# EAGLE board main_board (EAGLE 5.01), part 1 of 2
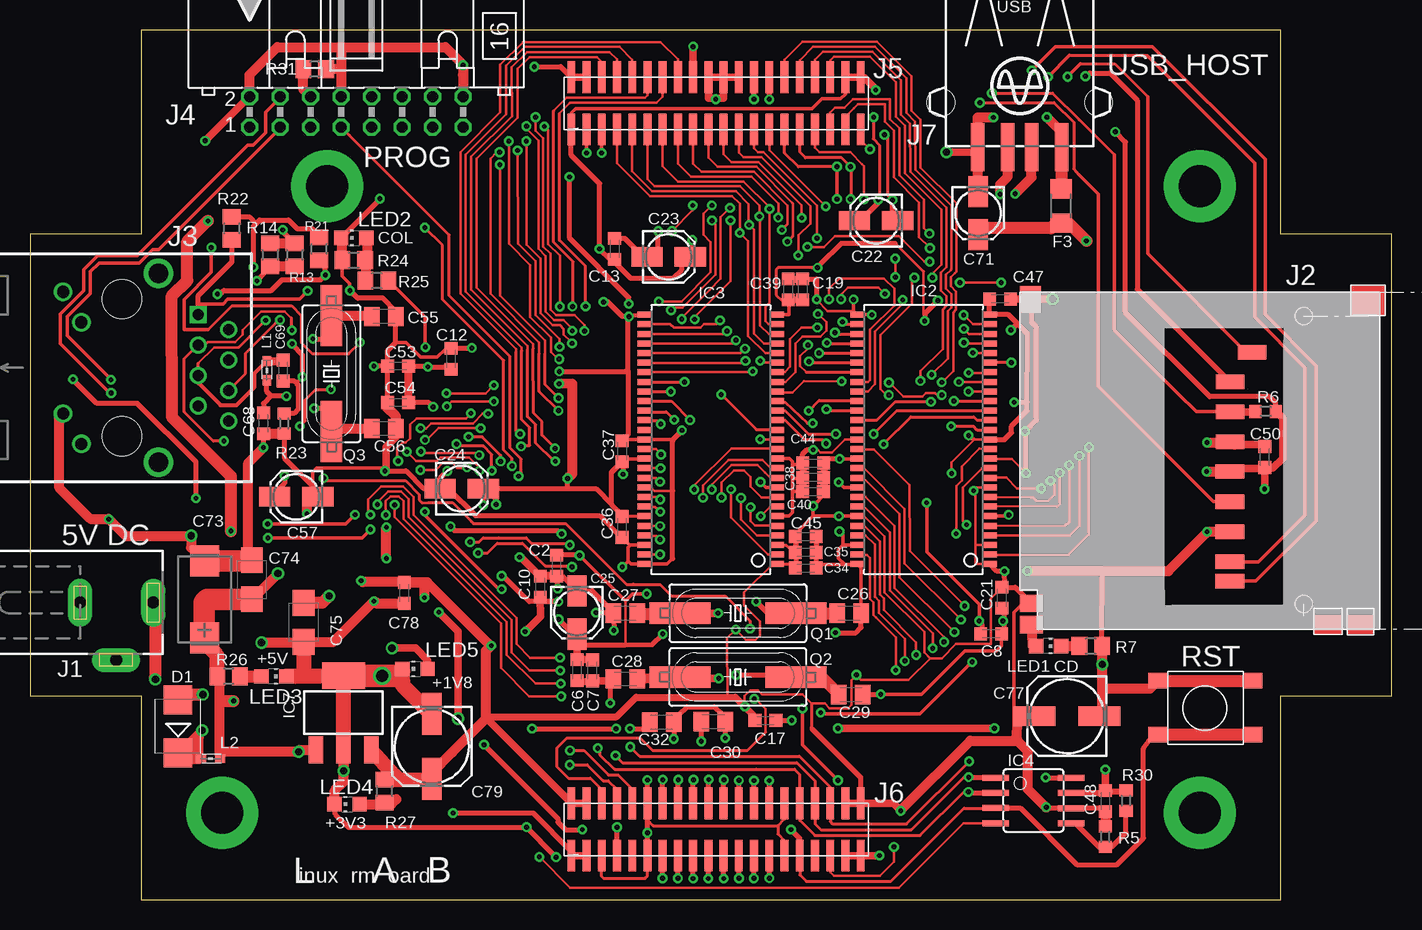
[diagram p2: board, top side]
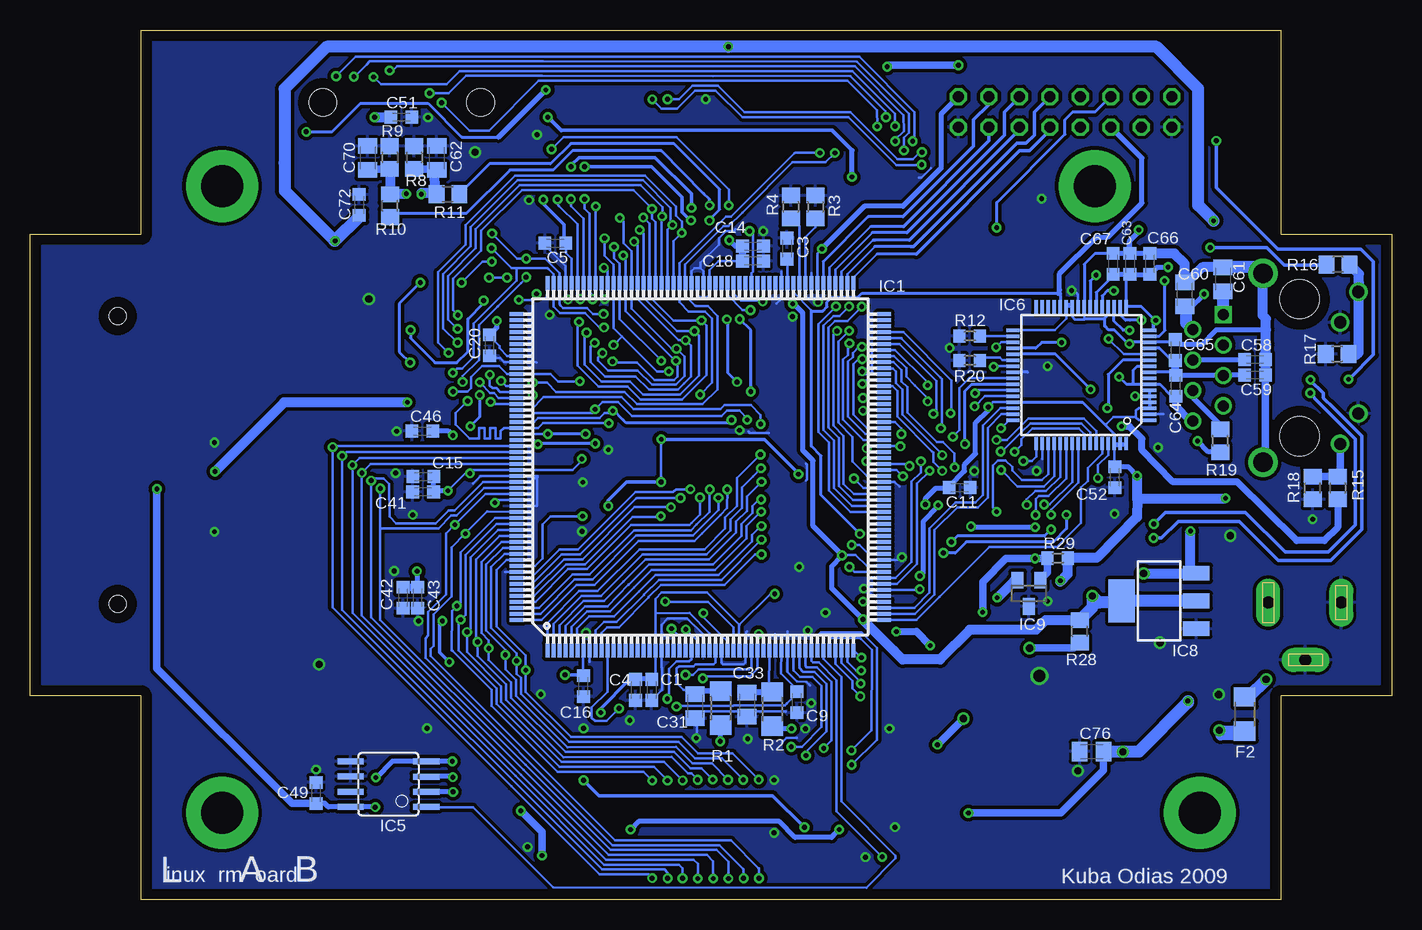
[diagram p3: board, bottom side, seen from below]

Size 113.5 x 72.5 mm. Coordinates in mm from the lower left corner, seen from the top.
Outline: 9.25,0 104.25,0 104.25,17 113.5,17 113.5,55.5 104.25,55.5 104.25,72.5 9.25,72.5 9.25,55.5 0,55.5 0,17 9.25,17 9.25,0
Copper layers (1*16): Top 0.035mm / dielectric 1.5mm / Bottom 0.035mm
Design rules "default *": minimum track width 0.2mm, minimum drill 0.4mm, track to track 0.2mm, track to pad 0.2mm, pad to pad 0.18mm, via to via 0.2mm, smd to smd 0.1mm, copper to edge 35mil, drill to drill 8mil, minimum pad ring 10mil, minimum via ring 8mil, stop-mask expansion 4mil, vias tented up to drill 0mil, thermal gap 10mil

## Footprints (pad centres in the part's own frame; a part is rotated, then mirrored left to right if it is on the bottom)
C0603K = smd 1.05 x 1.08: 1 -0.875,0; 2 0.875,0
153CLV-0405 = smd 2.6 x 1.6: + 1.8,0; - -1.8,0
C0805K = smd 1.3 x 1.6: 1 -1,0; 2 1,0
CT7343 = smd 2.6 x 2.4: + -3.2,0; - 3.2,0
B/3528-21W = smd 2.15 x 1.8: + 1.625,0; - -1.625,0
153CLV-0605 = smd 3.5 x 1.6: + 2.7,0; - -2.7,0
SMB = smd 2.4 x 2.4: A 2.2,0; C -2.2,0
R1206 = smd 1.6 x 1.803: 1 1.118,1.27; 2 3.962,1.27
PQFP208 = smd 1.2 x 0.32: 1 -3.87,24.18; 2 -3.87,23.68; 3 -3.87,23.18; 4 -3.87,22.68; 5 -3.87,22.18; 6 -3.87,21.68; 7 -3.87,21.18; 8 -3.87,20.68; 9 -3.87,20.18; 10 -3.87,19.68; 11 -3.87,19.18; 12 -3.87,18.68; 13 -3.87,18.18; 14 -3.87,17.68; 15 -3.87,17.18; 16 -3.87,16.68; 17 -3.87,16.18; 18 -3.87,15.68; 19 -3.87,15.18; 20 -3.87,14.68; 21 -3.87,14.18; 22 -3.87,13.68; 23 -3.87,13.18; 24 -3.87,12.68; 25 -3.87,12.18; 26 -3.87,11.68; 27 -3.87,11.18; 28 -3.87,10.68; 29 -3.87,10.18; 30 -3.87,9.68; 31 -3.87,9.18; 32 -3.87,8.68; 33 -3.87,8.18; 34 -3.87,7.68; 35 -3.87,7.18; 36 -3.87,6.68; 37 -3.87,6.18; 38 -3.87,5.68; 39 -3.87,5.18; 40 -3.87,4.68; 41 -3.87,4.18; 42 -3.87,3.68; 43 -3.87,3.18; 44 -3.87,2.68; 45 -3.87,2.18; 46 -3.87,1.68; 47 -3.87,1.18; 48 -3.87,0.68; 49 -3.87,0.18; 50 -3.87,-0.32; 51 -3.87,-0.82; 52 -3.87,-1.32; 105 26.73,-1.32; 106 26.73,-0.82; 107 26.73,-0.32; 108 26.73,0.18; 109 26.73,0.68; 110 26.73,1.18; 111 26.73,1.68; 112 26.73,2.18; 113 26.73,2.68; 114 26.73,3.18; 115 26.73,3.68; 116 26.73,4.18; 117 26.73,4.68; 118 26.73,5.18; 119 26.73,5.68; 120 26.73,6.18; 121 26.73,6.68; 122 26.73,7.18; 123 26.73,7.68; 124 26.73,8.18; 125 26.73,8.68; 126 26.73,9.18; 127 26.73,9.68; 128 26.73,10.18; 129 26.73,10.68; 130 26.73,11.18; 131 26.73,11.68; 132 26.73,12.18; 133 26.73,12.68; 134 26.73,13.18; 135 26.73,13.68; 136 26.73,14.18; 137 26.73,14.68; 138 26.73,15.18; 139 26.73,15.68; 140 26.73,16.18; 141 26.73,16.68; 142 26.73,17.18; 143 26.73,17.68; 144 26.73,18.18; 145 26.73,18.68; 146 26.73,19.18; 147 26.73,19.68; 148 26.73,20.18; 149 26.73,20.68; 150 26.73,21.18; 151 26.73,21.68; 152 26.73,22.18; 153 26.73,22.68; 154 26.73,23.18; 155 26.73,23.68; 156 26.73,24.18 | smd 0.32 x 1.2: 53 -1.32,-3.87; 54 -0.82,-3.87; 55 -0.32,-3.87; 56 0.18,-3.87; 57 0.68,-3.87; 58 1.18,-3.87; 59 1.68,-3.87; 60 2.18,-3.87; 61 2.68,-3.87; 62 3.18,-3.87; 63 3.68,-3.87; 64 4.18,-3.87; 65 4.68,-3.87; 66 5.18,-3.87; 67 5.68,-3.87; 68 6.18,-3.87; 69 6.68,-3.87; 70 7.18,-3.87; 71 7.68,-3.87; 72 8.18,-3.87; 73 8.68,-3.87; 74 9.18,-3.87; 75 9.68,-3.87; 76 10.18,-3.87; 77 10.68,-3.87; 78 11.18,-3.87; 79 11.68,-3.87; 80 12.18,-3.87; 81 12.68,-3.87; 82 13.18,-3.87; 83 13.68,-3.87; 84 14.18,-3.87; 85 14.68,-3.87; 86 15.18,-3.87; 87 15.68,-3.87; 88 16.18,-3.87; 89 16.68,-3.87; 90 17.18,-3.87; 91 17.68,-3.87; 92 18.18,-3.87; 93 18.68,-3.87; 94 19.18,-3.87; 95 19.68,-3.87; 96 20.18,-3.87; 97 20.68,-3.87; 98 21.18,-3.87; 99 21.68,-3.87; 100 22.18,-3.87; 101 22.68,-3.87; 102 23.18,-3.87; 103 23.68,-3.87; 104 24.18,-3.87; 157 24.18,26.73; 158 23.68,26.73; 159 23.18,26.73; 160 22.68,26.73; 161 22.18,26.73; 162 21.68,26.73; 163 21.18,26.73; 164 20.68,26.73; 165 20.18,26.73; 166 19.68,26.73; 167 19.18,26.73; 168 18.68,26.73; 169 18.18,26.73; 170 17.68,26.73; 171 17.18,26.73; 172 16.68,26.73; 173 16.18,26.73; 174 15.68,26.73; 175 15.18,26.73; 176 14.68,26.73; 177 14.18,26.73; 178 13.68,26.73; 179 13.18,26.73; 180 12.68,26.73; 181 12.18,26.73; 182 11.68,26.73; 183 11.18,26.73; 184 10.68,26.73; 185 10.18,26.73; 186 9.68,26.73; 187 9.18,26.73; 188 8.68,26.73; 189 8.18,26.73; 190 7.68,26.73; 191 7.18,26.73; 192 6.68,26.73; 193 6.18,26.73; 194 5.68,26.73; 195 5.18,26.73; 196 4.68,26.73; 197 4.18,26.73; 198 3.68,26.73; 199 3.18,26.73; 200 2.68,26.73; 201 2.18,26.73; 202 1.68,26.73; 203 1.18,26.73; 204 0.68,26.73; 205 0.18,26.73; 206 -0.32,26.73; 207 -0.82,26.73; 208 -1.32,26.73
TSOP54 = smd 0.5 x 1.2: 1 1.03,-0.422; 2 1.83,-0.422; 3 2.63,-0.422; 4 3.43,-0.422; 5 4.23,-0.422; 6 5.03,-0.422; 7 5.83,-0.422; 8 6.63,-0.422; 9 7.43,-0.422; 10 8.23,-0.422; 11 9.03,-0.422; 12 9.83,-0.422; 13 10.63,-0.422; 14 11.43,-0.422; 15 12.23,-0.422; 16 13.03,-0.422; 17 13.83,-0.422; 18 14.63,-0.422; 19 15.43,-0.422; 20 16.23,-0.422; 21 17.03,-0.422; 22 17.83,-0.422; 23 18.63,-0.422; 24 19.43,-0.422; 25 20.23,-0.422; 26 21.03,-0.422; 27 21.83,-0.422; 28 21.83,10.582; 29 21.03,10.582; 30 20.23,10.582; 31 19.43,10.582; 32 18.63,10.582; 33 17.83,10.582; 34 17.03,10.582; 35 16.23,10.582; 36 15.43,10.582; 37 14.63,10.582; 38 13.83,10.582; 39 13.03,10.582; 40 12.23,10.582; 41 11.43,10.582; 42 10.63,10.582; 43 9.83,10.582; 44 9.03,10.582; 45 8.23,10.582; 46 7.43,10.582; 47 6.63,10.582; 48 5.83,10.582; 49 5.03,10.582; 50 4.23,10.582; 51 3.43,10.582; 52 2.63,10.582; 53 1.83,10.582; 54 1.03,10.582
SOIC8 = smd 0.5 x 2.2: 1 0.635,-0.614; 2 1.895,-0.614; 3 3.165,-0.614; 4 4.435,-0.614; 5 4.445,5.694; 6 3.175,5.694; 7 1.905,5.694; 8 0.635,5.694
LQFP64 = smd 1.1 x 0.285: 1 -5.7,3.75; 2 -5.7,3.25; 3 -5.7,2.75; 4 -5.7,2.25; 5 -5.7,1.75; 6 -5.7,1.25; 7 -5.7,0.75; 8 -5.7,0.25; 9 -5.7,-0.25; 10 -5.7,-0.75; 11 -5.7,-1.25; 12 -5.7,-1.75; 13 -5.7,-2.25; 14 -5.7,-2.75; 15 -5.7,-3.25; 16 -5.7,-3.75; 33 5.7,-3.75; 34 5.7,-3.25; 35 5.7,-2.75; 36 5.7,-2.25; 37 5.7,-1.75; 38 5.7,-1.25; 39 5.7,-0.75; 40 5.7,-0.25; 41 5.7,0.25; 42 5.7,0.75; 43 5.7,1.25; 44 5.7,1.75; 45 5.7,2.25; 46 5.7,2.75; 47 5.7,3.25; 48 5.7,3.75 | smd 0.285 x 1.1: 17 -3.75,-5.7; 18 -3.25,-5.7; 19 -2.75,-5.7; 20 -2.25,-5.7; 21 -1.75,-5.7; 22 -1.25,-5.7; 23 -0.75,-5.7; 24 -0.25,-5.7; 25 0.25,-5.7; 26 0.75,-5.7; 27 1.25,-5.7; 28 1.75,-5.7; 29 2.25,-5.7; 30 2.75,-5.7; 31 3.25,-5.7; 32 3.75,-5.7; 49 3.75,5.7; 50 3.25,5.7; 51 2.75,5.7; 52 2.25,5.7; 53 1.75,5.7; 54 1.25,5.7; 55 0.75,5.7; 56 0.25,5.7; 57 -0.25,5.7; 58 -0.75,5.7; 59 -1.25,5.7; 60 -1.75,5.7; 61 -2.25,5.7; 62 -2.75,5.7; 63 -3.25,5.7; 64 -3.75,5.7
SOT223 = smd 1.219 x 2.235: 1 1.499,0.711; 2 3.81,0.711; 3 6.121,0.711 | smd 3.6 x 2.2: 4 3.81,6.909
SOT23 = smd 1 x 1.4: 1 0.32,1.44; 2 2.22,1.44; 3 1.27,3.64
DCJ0303 = drill 1 pad 2 long: 1 0,3.1; 2 4.8,0; 3 0,-3
SDCARD = smd 2.4 x 1.2: 1 17.53,-5.46; 2 17.53,-7.96; 3 17.53,-10.47; 4 17.525,-12.955; 5 17.525,-15.46; 6 17.525,-17.965; 7 17.52,-20.47; 8 17.525,-22.085; 9 19.37,-3 | smd 1.95 x 1.4: CD 0.975,-23.95 | smd 1.95 x 1.45: COMM 0.975,-25.735 | smd 1.75 x 2.2: S3 0.88,1.405 | hole 1.4: 23.68,0; 23.675,-24
PJ-J0 = drill 0.914 square: 1 -5.715,5.08 | drill 0.914 round: 2 -6.985,2.54; 3 -8.255,5.08; 4 -9.525,2.54; 5 -10.795,5.08; 6 -12.065,2.54; 7 -13.335,5.08; 8 -14.605,2.54 | drill 1.016 round: 9 -3.835,16.332; 10 -6.375,14.808; 11 -13.97,16.332; 12 -16.51,14.808 | drill 1.626 round: S1 -18.034,8.382; S2 -2.286,8.382 | hole 3.251: -15.875,11.43; -4.445,11.43
ML16L = drill 0.914 octagon: 1 -8.89,-1.27; 2 -8.89,1.27; 3 -6.35,-1.27; 4 -6.35,1.27; 5 -3.81,-1.27; 6 -3.81,1.27; 7 -1.27,-1.27; 8 -1.27,1.27; 9 1.27,-1.27; 10 1.27,1.27; 11 3.81,-1.27; 12 3.81,1.27; 13 6.35,-1.27; 14 6.35,1.27; 15 8.89,-1.27; 16 8.89,1.27
PLHTD40S-GC = smd 2.65 x 0.65: 1 0,24.13; 2 0,22.86; 3 0,21.59; 4 0,20.32; 5 0,19.05; 6 0,17.78; 7 0,16.51; 8 0,15.24; 9 0,13.97; 10 0,12.7; 11 0,11.43; 12 0,10.16; 13 0,8.89; 14 0,7.62; 15 0,6.35; 16 0,5.08; 17 0,3.81; 18 0,2.54; 19 0,1.27; 20 0,0; 21 4.35,0; 22 4.35,1.27; 23 4.35,2.54; 24 4.35,3.81; 25 4.35,5.08; 26 4.35,6.35; 27 4.35,7.62; 28 4.35,8.89; 29 4.35,10.16; 30 4.35,11.43; 31 4.35,12.7; 32 4.35,13.97; 33 4.35,15.24; 34 4.35,16.51; 35 4.35,17.78; 36 4.35,19.05; 37 4.35,20.32; 38 4.35,21.59; 39 4.35,22.86; 40 4.35,24.13
USB-A003 = smd 1.12 x 4: 1 -3.5,14; 2 -1,14; 3 1,14; 4 3.5,14 | hole 2.3: -6.57,10.28; 6.57,10.28
0603 = smd 0.85 x 0.7: 1 -0.9,0; 2 0.7,0
CHIP-LED0805 = smd 1.2 x 1.2: A 0,-1.05; C 0,1.05
SM49 = smd 5.08 x 1.778: 1 -4.826,0; 2 4.826,0
R1206' = smd 1.6 x 1.803: 1 -1.422,0; 2 1.422,0
R0805 = smd 1.3 x 1.5: 1 -0.95,0; 2 0.95,0
R0603 = smd 1 x 1.1: 1 -0.85,0; 2 0.85,0
DTSM-62N = smd 1.3 x 1.55: P$1 0,0; P$2 0,7.95; P$3 4.5,0; P$4 4.5,7.95

## Placement (x,y rotation side)
C1  100n  [C0603K]  61.67,17.48 270 bottom
C2  100n  [C0603K]  43.9,27.84 270 top
C3  100n  [C0603K]  50.38,54.27 90 bottom
C4  100n  [C0603K]  63.01,17.48 270 bottom
C5  100n  [C0603K]  69.7,54.71 180 bottom
C6  100n  [C0603K]  45.6,19.12 270 top
C7  100n  [C0603K]  46.88,19.11 270 top
C8  100n  [C0603K]  80.12,22.16 0 top
C9  100n  [C0603K]  49.57,16.44 270 bottom
C10  100n  [C0603K]  42.54,26.09 90 top
C11  100n  [C0603K]  35.99,34.34 0 bottom
C12  100n  [C0603K]  35.1,45.09 90 top
C13  100n  [C0603K]  48.74,54.25 90 top
C14  100n  [C0603K]  53.23,54.47 0 bottom
C15  100n  [C0603K]  80.72,35.25 180 bottom
C16  100n  [C0603K]  67.36,17.8 270 bottom
C17  100n  [C0603K]  61.31,14.92 0 top
C18  100n  [C0603K]  53.23,53.24 0 bottom
C19  100n  [C0603K]  64.4,50.87 90 top
C20  100n  [C0603K]  75.19,46.2 270 bottom
C21  100n  [C0603K]  81,25.16 270 top
C22  10uF/25V  [153CLV-0405]  70.53,56.6 180 top
C23  10uF/25V  [153CLV-0405]  53.24,53.58 0 top
C24  10uF/25V  [153CLV-0405]  35.99,34.26 0 top
C25  10uF/25V  [153CLV-0405]  45.59,23.93 270 top
C26  10p  [C0805K]  68.28,23.88 180 top
C27  10p  [C0805K]  49.61,23.88 0 top
C28  10p  [C0805K]  49.63,18.4 0 top
C29  10p  [C0805K]  68.43,17.09 180 top
C30  5.6n  [C0805K]  56.96,14.83 180 top
C31  680p  [C0805K]  58.05,16.12 90 bottom
C32  4.7n  [C0805K]  52.65,14.79 180 top
C33  470p  [C0805K]  53.73,16.24 90 bottom
C34  100n  [C0603K]  64.68,27.63 0 top
C35  100n  [C0603K]  64.68,28.95 0 top
C36  100n  [C0603K]  49.35,31.06 270 top
C37  100n  [C0603K]  49.36,37.39 90 top
C38  100n  [C0603K]  65.28,35.2 180 top
C39  100n  [C0603K]  63.21,50.87 90 top
C40  100n  [C0603K]  65.27,34.01 180 top
C41  100n  [C0603K]  80.73,33.99 180 bottom
C42  100n  [C0603K]  82.4,25.16 270 bottom
C43  100n  [C0603K]  81.19,25.16 270 bottom
C44  100n  [C0603K]  65.28,36.39 180 top
C45  100n  [C0603K]  64.68,30.26 0 top
C46  100n  [C0603K]  80.79,39.06 180 bottom
C47  100n  [C0603K]  80.87,50.07 0 top
C48  100n  [C0603K]  89.65,8.22 270 top
C49  100n  [C0603K]  89.65,8.89 270 bottom
C50  100n  [C0603K]  102.92,36.89 270 top
C51  100n  [C0603K]  82.55,65.23 0 bottom
C52  100n  [C0603K]  23.07,35.21 270 bottom
C53  100n  [C0603K]  30.69,44.48 180 top
C54  100n  [C0603K]  30.69,41.43 180 top
C55  22p  [C0805K]  29.52,48.61 180 top
C56  22p  [C0805K]  29.52,39.27 180 top
C57  10uF/25V  [153CLV-0405]  22.2,33.58 180 top
C58  100n  [C0603K]  11.39,45.02 0 bottom
C59  100n  [C0603K]  11.39,43.73 0 bottom
C60  10p  [C0805K]  17.24,50.45 270 bottom
C61  10p  [C0805K]  14.05,51.72 270 bottom
C62  47p  [C0805K]  79.59,61.82 90 bottom
C63  100n  [C0603K]  21.8,52.99 90 bottom
C64  100n  [C0603K]  17.99,42.83 270 bottom
C65  100n  [C0603K]  18.02,45.82 90 bottom
C66  100n  [C0603K]  20.15,52.99 90 bottom
C67  100n  [C0603K]  23.21,52.99 90 bottom
C68  100n  [C0603K]  19.46,39.7 270 top
C69  100n  [C0603K]  21.1,44.1 270 top
C70  47p  [C0805K]  85.35,61.83 90 bottom
C71  10uF/10V  [153CLV-0405]  79.04,57.23 270 top
C72  100n  [C0603K]  86.05,57.91 90 bottom
C73  100uF/16V  [CT7343]  14.56,25.02 90 top
C74  10uF/16V  [B/3528-21W]  18.5,26.67 270 top
C75  10uF/16V  [B/3528-21W]  22.82,23.11 90 top
C76  470n  [C0805K]  25,12.34 0 bottom
C77  47uF/16V  [153CLV-0605]  86.44,15.29 180 top
C78  100n  [C0603K]  31.21,25.56 270 top
C79  47uF/16V  [153CLV-0605]  33.5,12.77 270 top
D1  P6SMB6,8A  [SMB]  12.34,14.44 90 top
F2  1A  [R1206]  10.97,12.92 90 bottom
F3  0.25A  [R1206]  84.68,60.37 270 top
IC1  AT91RM9200  [PQFP208]  46.18,24.64 90 bottom
IC2  K4S561632J  [TSOP54]  79.56,26.93 90 top
IC3  K4S561632J  [TSOP54]  61.84,26.93 90 top
IC4  AT45DB021D  [SOIC8]  81.11,10.8 270 top
IC5  AT93C66  [SOIC8]  81.08,7.08 90 bottom
IC6  STE100P-LQFP64  [LQFP64]  25.86,43.72 180 bottom
IC7  LM3940IMP-3.3  [SOT223]  22.33,11.77 0 top
IC8  LM1117MP-1.8  [SOT223]  15.58,21.08 90 bottom
IC9  DS1818  [SOT23]  28.96,28.07 180 bottom
J1  5V DC  [DCJ0303]  7.18,24.77 270 top
J2  X6173-15  [SDCARD]  82.51,48.64 0 top
J3  J0011  [PJ-J0]  19.09,54.5 90 top
J4  PROG  [ML16L]  27.2,65.67 0 top
J5  PLHTD40S-GC  [PLHTD40S-GC]  69.25,64.2 90 top
J6  PLHTD40S-GC  [PLHTD40S-GC]  69.25,3.66 90 top
J7  USB_HOST  [USB-A003]  82.52,76.73 180 top
L1  LCBA-601  [0603]  19.74,44.2 90 top
L2  LCBA-601  [0603]  15.14,11.74 0 top
LED1  YELLOW  [CHIP-LED0805]  84.92,21.14 270 top
LED2  RED  [CHIP-LED0805]  26.99,55.16 90 top
LED3  GREEN  [CHIP-LED0805]  20.34,18.61 270 top
LED4  YELLOW  [CHIP-LED0805]  26.43,7.95 90 top
LED5  RED  [CHIP-LED0805]  32.1,19.23 90 top
Q1  18.432M  [SM49]  59.01,23.88 0 top
Q2  32.768k  [SM49]  59.01,18.54 180 top
Q3  25M  [SM49]  25.13,43.85 90 top
R1  1.27k/1%  [R1206']  55.93,15.96 90 bottom
R2  1.96k/1%  [R1206']  51.62,15.88 90 bottom
R3  1k  [R0805]  48.03,57.75 270 bottom
R4  1k  [R0805]  50.07,57.75 270 bottom
R5  10k  [R0603]  89.64,5.24 90 top
R6  10k  [R0603]  103.01,40.7 0 top
R7  390R  [R0805]  88.43,21.13 180 top
R8  15k  [R0805]  81.47,61.87 270 bottom
R9  15k  [R0805]  83.5,61.87 270 bottom
R10  27R  [R0805]  83.5,57.84 90 bottom
R11  27R  [R0805]  78.66,58.81 0 bottom
R12  10k  [R0603]  35.15,46.99 0 bottom
R13  10k/1%  [R0805]  22.05,53.75 270 top
R14  10k/1%  [R0805]  20.02,53.75 270 top
R15  330R  [R0805]  4.49,34.31 270 bottom
R16  330R  [R0805]  4.45,52.96 180 bottom
R17  1k  [R0805]  4.53,45.5 0 bottom
R18  1k  [R0805]  6.58,34.31 90 bottom
R19  100R  [R0805]  14.27,38.24 90 bottom
R20  10k  [R0603]  35.15,44.94 0 bottom
R21  49.9R/1%  [R0805]  24.1,54.25 90 top
R22  49.9R/1%  [R0805]  16.83,55.95 90 top
R23  0R  [R0603]  21.2,39.69 90 top
R24  1k  [R0805]  26.99,53.31 0 top
R25  330R  [R0805]  28.91,51.59 180 top
R26  560R  [R0805]  16.56,18.61 180 top
R27  220R  [R0805]  29.56,9.04 90 top
R28  0R  [R0805]  25.99,22.35 90 bottom
R29  10k  [R0603]  27.83,28.46 0 bottom
R30  0R  [R0603]  91.37,8.25 270 top
R31  47k  [R0805]  23.74,69.22 180 top
S1  RESET  [DTSM-62N]  101.96,13.74 90 top

## Tracks (layer width: path | path; a pad name or v marks a point on that pad's centre or on a via)
+1V8  (via drill 0.4, 0.6)
  Top 0.2: C25.+ 45.61,22.1 45.4,21.24 | 49.62,21.24 49.63,24.89
  Top 0.254: v70.72,58.35 70.83,58.47 70.83,58.51 70.83,62.9 70.3,63.42 70.31,65.13 v70.33,65.23
  Top 0.305: v51.42,25.48 50.21,25.48 49.63,24.9 49.63,24.89 45.99,28.52 | v74.76,33.08 74.76,28.96 79.13,24.6 v79.13,23.23 | v78.54,19.8 74.2,15.46 66.03,15.47 v65.91,15.59
  Top 0.406: 45.4,21.24 49.62,21.24 51.87,21.26 52.72,22.11 v52.76,22.14 | v79.13,23.23 79.31,22.98 79.33,22.94 79.34,22.4 C8.1 | 69.46,56.86 68.77,56.69 | 69.46,56.86 C22.+ | v70.72,58.35 70.72,58.12 69.46,56.86 | v44.99,60.24 44.99,55.13 49.91,50.2 v49.91,49.67 v49.92,49.66 | C25.+ 45.3,22.12 v44.07,23.35 | C25.+ | C25.+ 45.61,22.12 | C25.+ 45.6,22.19 | C2.1 45.79,28.71 v45.82,28.69
  Top 0.61: 45.61,20.02 C6.1 | 45.61,22.12 45.61,20.02 | 46.9,20 46.9,19.98 | 46.9,20 C7.1 | 45.61,20.02 46.9,20.02 46.9,20
  Top 1.016: C75.+ 24.37,24.74 v24.93,25.3
  Bottom 0.2: IC1.33 54.38,20.79 54.38,22.88 | 54.38,22.88 54.38,22.92 57.06,25.61 60.84,25.61 61.37,25.08 61.37,23.87 | C1.1 61.7,18.35 61.7,18.36 61.37,18.7 IC1.19 61.36,20.67 61.37,20.67 | 61.37,23.87 58.53,23.88 56.86,22.17 56.86,20.92 56.87,20.83 56.86,20.79 IC1.28 | 61.37,23.87 61.37,20.67 | 61.37,20.67 | 54.38,22.88 | 54.38,22.88 54.35,22.91 | IC1.37 52.35,21.72 v52.76,22.14 | 54.38,22.88 54.38,22.9 51.78,25.47 51.63,25.47 v51.42,25.48 | 72.93,33.33 IC1.188 74.52,33.32 v74.76,33.08 | C5.1 68.8,53.91 68.81,53.91 68.36,53.46 IC1.152 | 50.41,53.39 50.42,53.4 | 50.41,53.39 C3.1 | 50.41,53.39 50.36,53.34 IC1.116 50.37,51.36 50.35,50.33 50.35,50.1 v49.92,49.66 | IC1.62 43.74,27.82 44.67,28.75 45.83,28.75 45.84,28.73 | 45.84,28.73 | 45.84,28.73 45.82,28.73
  Bottom 0.305: v79.13,23.23 79.23,23.2 79.34,23.09 79.33,20.6 v78.54,19.8 | v65.91,15.59 65.95,15.9 63.56,18.33 63.04,18.33 63.03,18.32 C4.1 | C5.1 68.98,54.87 68.98,56.26 70.72,58.01 v70.72,58.34 v70.72,58.35
  Bottom 0.35: v70.33,65.23 69.22,64.13 46.62,64.11 44.97,62.46
  Bottom 0.406: C4.1 63.05,18.37 63.05,18.38 61.73,18.38 61.7,18.35 | 45.82,28.73 48.22,31.14 48.22,36.6 49.07,37.46 49.07,48.9 49.82,49.65 49.88,49.62 v49.92,49.66 | 44.97,62.46 44.97,60.33 v44.99,60.24 | v44.07,23.35 46.65,25.93 46.65,27.79 45.84,28.6 45.84,28.69 | 45.84,28.69 45.84,28.73 | 45.84,28.69 v45.82,28.69
  Bottom 0.813: R28.2 26.01,23.29 28.84,23.29 29.63,22.49 35.16,22.49 37.64,20.01 40.76,20.02 41.47,20.74 44.07,23.33 v44.07,23.35
  Bottom 1.016: IC8.2 22.47,24.89 22.48,24.89 IC8.4 22.5,24.76 24.39,24.76 v24.93,25.3 24.95,25.28 24.95,24.34 R28.2
+3V3  (via drill 0.4)
  Top 0.2: 60.46,15.21 C17.1 | 58.13,16.96 58.12,21.8 v58.82,22.5 v58.83,22.51 59.68,21.66 60.48,21.66 60.85,22.04 60.85,23.2 59.54,24.51 59.54,25.62 61.95,27.99 62.17,27.99 | 62.17,27.99 62.21,27.99 | 62.17,27.99 IC3.1 62.23,27.95 | IC3.3 62.24,29.54 62.57,29.54 | C35.1 63.81,29.27 63.74,29.34 | 63.84,27.66 63.65,27.95 | 51.23,31.96 IC3.49 | 51.34,36.74 51.22,36.74 IC3.43 | C37.1 49.7,36.74 | 62.28,38.34 62.32,38.34 | 62.28,38.34 IC3.14 | v60.88,38.37 60.88,38.35 62.28,38.34 | 63.25,49.99 C39.1 | 48.35,53.38 C13.1 | IC2.43 68.98,36.75 68.99,36.74 69.01,36.72 | IC2.9 78.96,34.37 v78.67,34.08 78.81,33.92 78.81,29.58 | IC2.1 78.81,27.96 78.81,29.58 | 78.81,29.58 78.88,29.58 78.88,29.56 IC2.3 | v76.83,35.53 76.82,36.45 78.73,38.36 IC2.14 | 69.12,31.96 69.53,31.96 71.24,30.25 71.24,25.61 74.55,22.3 74.55,20.81 74.55,20.59 75.03,20.11 75.05,20.11 74.55,20.61 | 81.35,26.17 81.19,26.01 81.05,26.01 81.02,26.01 80.12,25.11 80.12,21.3 78.05,21.3 78.1,21.29 77.2,21.29 76.02,20.12 75.04,20.12 73.24,18.32 69.27,18.32 68.92,18.67 68.92,18.71 v68.89,18.73 68.71,18.5 68.46,18.25 68.46,16.22 68.18,15.95 67.2,15.95 66.66,15.95 66.26,16.34 65.16,16.34 64.39,17.12 63.98,17.11 61.02,17.11 60.69,17.44 60.04,17.44 59.57,16.97 59.57,16.12 v59.6,16.09 | C45.1 63.79,30.31 | C45.1 | 63.85,30.16 63.79,30.22 C45.1 | C19.1 64.01,49.99 63.95,49.94 62.68,49.94 | 74.58,48.83 74.49,48.84 74.49,49.77 74.49,52.37 | 31.56,41.51 31.56,41.49 31.59,41.46 33.22,41.46 v33.61,41.06 | v33.61,41.06 33.63,41.04 | v33.61,41.07 v33.61,41.06 | IC2.49 69.12,31.96 | 69.12,31.96 69.15,31.96 69.15,31.94 | 67.44,31.94 67.44,31.93 | 67.44,31.94 v67.44,31.96
  Top 0.2: 69.15,31.94 67.44,31.94 | 69.12,31.96 69.12,31.97 | 69.12,31.96 | 69.15,31.94 69.12,31.94 69.12,31.96 | IC2.27 79.98,48.77 | IC2.27 | IC2.27 | 65.16,14.2 65.16,14.19 65.2,14.22 | 20.1,41.99 20.17,41.99 IC6.5 v21.39,41.97 v21.38,41.97
  Top 0.254: 63.74,29.34 63.26,29.34 63.06,29.54 62.57,29.54 | 63.65,27.95 62.23,27.95 | 78.73,38.36 78.73,38.39 78.24,38.38 v78.24,38.7 | v65.66,52.68 65.39,52.68 65.22,52.68 62.37,52.69 62.2,52.51 62.2,50.42 62.68,49.94 | 74.49,52.37 72.14,54.71 | 86.8,7.64 IC4.6 | v84.72,7.7 84.77,7.64 | 65.16,16.34 65.16,14.37 | 35.14,44.25 35.11,44.22 C12.1
  Top 0.3: 65.27,31.97 63.81,30.49 | 65.28,32.83 65.97,33.51 66.3,33.85 v65.3,32.82
  Top 0.305: 60.46,15.23 60.46,15.27 | 49.47,31.97 51.23,31.96 | 49.7,36.74 51.22,36.74 | IC3.9 61.35,34.37 v60.89,34.8 | IC3.27 63.25,48.76 63.25,49.99 | C13.1 48.68,53.19 | v67.44,31.96 67.47,31.96 | v67.49,36.74 68.99,36.74 | 63.81,30.49 63.81,29.27 | 44.58,34.27 44.58,34.26 44.82,34.25 | J2.CD 82.76,24.69 82.03,23.95 82.02,13.35 | IC2.49 65.27,31.96 65.27,31.97 65.27,31.96 65.28,31.96 65.28,32.83 | J5.21 J5.22 67.98,67.17 67.58,66.77 66.02,66.77 65.2,65.95 45.49,65.95 45.13,65.6 45.13,64.24 45.15,64.23 45.15,64.31 45.12,64.34 | 65.16,14.37 65.16,14.2
  Top 0.31: 84.73,7.69 84.74,7.69 | 84.73,7.69 v84.72,7.7 | 84.71,7.69 84.73,7.69 | 81.05,26.01 81.17,26.01 C43.1 | 82.23,25.94 | 82.23,25.94 82.23,25.95 | 82.14,26.03 82.23,25.94 | 72.2,7.66 72.2,7.7 | 69.12,31.96 69.13,31.95
  Top 0.406: IC4.6 | C48.2 89.36,7.64 86.78,7.64 | 60.46,15.21 60.46,15.23 v59.6,16.09 | C35.1 63.85,30.16 63.84,27.66 C34.1 | C36.1 49.42,32.26 49.47,31.97 48.49,32.95 | 49.49,36.46 C37.1 49.36,36.54 | 48.49,32.95 48.49,35.6 | IC2.27 79.97,48.77 79.97,50.36 | 55.21,53.42 v55.21,54.98 | 48.68,53.19 50.07,51.8 53.59,51.79 54.34,52.54 54.34,52.55 54.34,52.56 54.34,52.57 54.34,53.17 54.6,53.42 55.21,53.42 | 48.35,53.38 v47.48,54.25 v47.48,54.26 47.48,59.7 45.12,62.06 J5.1 | 49.36,36.54 49.38,36.55 | 48.49,35.6 48.49,35.67 49.36,36.54 | 48.49,35.6 49.39,36.51 49.42,36.51 49.44,36.49 v49.44,35.45 | 48.49,32.95 47.18,34.27 44.58,34.27 38.77,34.27 38.79,34.25 v38.85,32.93 38.85,34.23 37.81,34.24 C24.+ | IC2.1 80.02,27.96 80.61,27.37 v81.24,27.37 81.27,27.37 81.28,27.36 81.25,27.28 81.26,26.26 81.19,26.19 C21.1 C43.1 82.14,26.03 | v67.49,36.74 v67.49,36.73 66.61,36.73 66.21,36.33 | C47.1 IC2.27 81.58,48.76 82.28,48.05 82.32,48.02 | 82.32,48.02 83.13,47.21 83.11,40.75 | 83.11,40.75 81.82,39.46 81.82,38.92 81.23,38.34 80.01,38.34 IC2.14 | v74.58,48.24 74.58,48.83 v75.69,49.93 | 82.32,48.02 82.28,47.98 82.28,47.92 82.22,47.92 v81.78,47.48 | v65.66,52.68 65.85,52.93 67.63,54.71 72.14,54.71 | C57.+ 20.45,33.94 21.21,34.71 v21.21,35.33 | C53.1 33.05,44.48 v33.17,44.41 33.36,44.41 34.54,44.41 35.17,44.41 35.1,44.29 C12.1 35.08,44.5 | C54.1 33.25,41.43 v33.61,41.07 | C68.1 19.46,41.37 20.07,41.98 v21.37,41.98 v21.38,41.97 | L1.1 19.74,42.36 20.1,41.99 | 37.79,34.23 37.83,34.19 | C24.+ 37.79,34.23 | 37.79,34.23 37.64,34.38 | 37.79,34.21 | 37.79,34.21 C24.+ | v37.79,32.88 37.79,34.21 | 42.54,25.13 C10.1 42.91,24.84 v44.05,24.84 41.61,24.84 41.04,25.4 39.45,26.98 v39.32,26.98
  Top 0.406: C24.+ 37.68,34.37 | v44.82,35.1 44.81,35.1 44.81,34.26 44.58,34.26 | v13.83,33.46 13.83,36.48 8.94,41.37 5.58,41.37 v3.58,43.37 | 18.31,66.99 J4.2 | v14.6,63.26 14.6,63.28 | 83.11,40.75 83.11,41.45 v82.05,41.45 | 82.76,24.69 82.78,25.4 82.23,25.95 82.2,25.98 | 84.77,7.64 86.8,7.64 | 72.57,7.43 72.58,7.41 v72.58,7.39 | 72.2,7.66 | 71.97,8.01 71.97,7.9 72.2,7.66 | R6.2 103.86,40.76 103.89,40.79 103.84,40.84 103.84,41.4 103.31,41.93 98.34,41.93 91.32,48.95 91.32,63.16 v90.47,64.01 | J5.40 44.23,69.44 v42.04,69.44 | 55.03,53.58 55.02,53.59 | 55.03,53.58 C23.+ | 55.21,53.42 55.19,53.42 55.03,53.58 | J6.21 69.23,8.03 69.23,10.19 65.2,14.22
  Top 0.508: 86.78,7.64 IC4.6
  Top 0.6: C44.1 66.21,36.33 66.21,35.17 66.18,35.17 C38.1 66.17,35.18 66.17,34.03 C40.1 | 64.44,49.99 C19.1 | 64.44,49.99 63.25,49.99 | 64.44,49.99 64.44,49.98 | 60.46,15.21 58.81,16.86 50.53,16.86 48.91,15.23 38,15.23
  Top 0.61: C50.2 102.93,35.93 100.27,35.93 J2.4 | R6.2 104.42,40.13 104.42,36.78 103.61,35.97 102.97,35.97 C50.2 | v41.28,22.33 42.56,23.6 42.54,25.13 | 14.6,63.28 18.31,66.99 | J6.40 45.19,8.01 45.2,8.03 45.22,8.01 J6.39 45.14,8.01 38.06,15.09 38,15.09 | 69.22,8.03 69.23,8.01 J6.21 71.97,8.01 v72.58,7.39 | 69.22,8.03 69.34,8.02 | v70.81,3.66 69.31,3.66 69.27,3.62 69.25,3.64 J6.20 68.17,3.66 68.15,3.64 68.13,3.66 J6.19 | J5.39 | J5.40 J5.39 | J5.39 | 68.03,68.55 J5.22 | 68.03,68.55 J5.21 69.28,68.52 69.56,68.53 70.48,67.61 70.6,67.5 v70.49,67.5 | 68.03,68.55 68.03,68.54 | 36.09,68.74 36.09,68.73 36.13,69.57 v36.1,69.56 | C50.2 v102.92,34.22 | J6.22 68,8.03 69.22,8.03
  Top 0.65: C53.1 IC6.39 31.56,41.51
  Top 0.813: C78.1 33.12,26.45 38.41,21.16 v38.45,21.16 38,20.74 38,15.23 38,15.09 35.2,12.26 33.55,10.6 33.5,10.53 C79.+ 33.5,10.43 | C78.1 31.21,26.46 31.43,26.46 31.46,26.44 32.87,26.43 v32.87,25.16 | C78.1 31.18,26.46 27.73,26.46 v27.61,26.59 | v44.1,43 45.23,43.01 45.22,36.05 45.22,35.5 v44.82,35.1 | 25.95,71.06 20.61,71.06 18.29,68.75 18.29,67.03 18.31,67.03 | 25.95,71.06 34.63,71.07 36.09,69.6 36.09,68.74 36.09,67.21 36.06,67.18 36.09,67.14 J4.16 | 18.31,67.03 18.33,67.03 | J4.2 18.31,67.03 | J4.8 25.94,66.96 25.95,69.29 | 25.95,71.06 25.95,69.29 | 100.03,35.67 100.04,35.66 | 100.03,35.67 J2.4 | v98.08,35.69 100.01,35.69 100.03,35.67 | C48.2 89.65,7.29 89.63,7.26 89.64,7.25 R5.2 | 84.71,7.69 83.16,9.22 83.16,12.21 83.18,12.36 | 83.18,12.36 82.3,13.23 78.39,13.23 72.57,7.43 | 83.18,12.36 82.14,13.4 82.29,13.37 82.31,14.95 | 25.95,69.29 25.86,69.29 25.79,69.22 R31.1 | 82.31,14.95 82.34,14.78 | 82.31,14.95 C77.+ | 33.5,10.43 | 33.48,10 33.48,10.41 33.5,10.43
  Top 1.27: IC7.3 30.41,10.33 30.67,10.04 30.49,10 R27.2 33.48,10 33.48,10.79
  Bottom 0.2: 23.1,36.06 23.1,36.05 | 23.1,36.06 arc90 C52.1 | IC6.62 arc90 23.1,38 | 23.1,38 23.1,36.06 | IC6.63 | IC6.63 arc90 22.8,37.83 23.11,37.83 arc90 22.92,38.01 IC6.64 arc-90 IC6.64 | 23.1,38 arc90 23.09,38.01 IC6.63 | IC6.64 arc90 22.3,37.84 22.89,37.84 | IC1.26 57.86,21.54 v58.83,22.51 | IC1.40 50.88,18.84 49.62,17.57 49.62,17.27 | 49.62,17.27 49.62,17.24 | 49.62,17.27 C9.1 49.57,17.2 50.41,16.36 50.44,16.33 50.56,16.2 54.83,16.2 54.91,16.14 57.13,16.14 59.51,16.14 v59.6,16.09 | IC1.7 67.38,20.75 67.38,18.69 C16.1 | v60.88,38.37 60.89,38.35 v60.89,34.8 60.9,34.8 | 60.9,34.8 60.9,34.78 | IC1.131 57.86,50.43 57.67,50.23 57.05,50.23 56.85,50.43 IC1.129 | IC1.129 56.84,51.38 | IC1.129 56.86,51.39 56.86,52.46 56.08,53.24 C18.1 | IC1.111 47.86,53.86 v47.48,54.25 | IC1.199 73.01,27.82 73.03,27.8 72.98,27.81 71.4,27.81 70.79,28.42 70.79,31.27 70.12,31.94 67.44,31.94 | IC1.183 72.91,35.84 | IC1.183 68.29,35.82 67.45,36.66 | 42.33,34.31 42.35,34.31 | 42.33,34.31 IC1.75 | v78.67,34.08 78.67,34.1 76.95,35.82 76.42,35.82 | 76.42,35.82 IC1.183 | 76.42,35.82 76.44,35.82 76.83,35.82 v76.83,35.53 | 60.91,34.8 60.9,34.8 | IC1.146 65.36,52.68 v65.66,52.68 | IC1.164 73.72,45.32 74.37,45.96 74.37,46.14 75.39,47.16 C20.1 | v33.17,44.41 33.12,44.47 IC6.39 | IC6.45 33.21,41.47 v33.61,41.07 33.61,41.06 | IC1.93 42.34,43.31 | IC1.93 | IC6.4 20.18,41.47 20.16,41.45 IC6.3 21.08,40.97 21.3,40.75 21.3,40.19 21.08,39.97 | IC6.6 20.16,42.48 20.18,42.49 | IC6.1 20.28,39.97 21.08,39.97 | IC6.64 22.1,38.02 | IC1.56 42.3,24.82 | IC1.56 | v44.05,24.84 44.03,24.82 IC1.56 | IC1.93 43.81,43.29 v44.1,43 | 42.33,34.31 44.02,34.31 v44.82,35.1 | 21.08,39.97 21.35,40.23 23.2,40.23 23.79,39.65
  Bottom 0.2: 23.79,39.65 | 23.86,39.57 23.79,39.65 | IC6.45 | IC6.45 31.56,41.44 31.5,41.47 33.2,41.47 33.61,41.06 | IC6.45 | 33.61,41.06 33.63,41.03 | v67.44,31.96 67.44,31.94 | 67.44,31.94 | C18.1 | C18.1 | v21.37,41.97 | v21.37,41.97 v21.38,41.97 | IC6.5 v21.37,41.97
  Bottom 0.254: v75.69,49.93 75.69,49.71 76.99,48.41 76.99,45.7 77.92,44.77 79.73,44.77 81.78,46.81 v81.78,47.48 | IC6.62 23.11,38.82 23.86,39.57 25.75,41.46 IC6.45 | R29.2 26.98,28.48 26.99,28.49 27.01,28.47 27.01,27.12 | v67.49,36.74 67.49,36.66 67.45,36.66 | v84.72,7.7 84.74,7.71 | 74.47,63.58 77.51,63.58 80.33,66.39 85.94,66.39 88.33,64 90.44,64 | 90.44,64 v90.47,64 | IC6.5 | IC6.5 20.16,41.5 20.16,41 IC6.4 | 20.16,42.48 IC6.5 | 90.44,64 90.44,64.01 v90.47,64.01
  Bottom 0.3: 60.91,34.8 63.77,34.8 | 63.77,34.8 63.77,34.79 | 63.77,34.8 65.29,33.28 v65.3,32.82
  Bottom 0.305: C16.1 67.44,18.74 v68.89,18.73 | v49.44,35.45 49.44,35.51 52.29,38.36 60.83,38.36 60.87,38.32 60.88,38.33 v60.88,38.37 | 3.4,43.53 1.5,45.43 1.5,53.17 2.55,54.22 9.46,54.22 14.6,59.35 v14.6,63.26 | 18.33,66.92 18.44,66.92 | J4.2 18.33,66.92 | 18.33,66.92 18.26,66.92
  Bottom 0.31: 21.21,33.55 21.28,33.55 21.2,33.48 21.2,33.39
  Bottom 0.406: v55.21,54.98 54.7,54.48 54.68,54.48 54.67,54.48 C14.1 | v38.85,32.93 38.85,33.45 37.98,34.31 37.13,34.3 36.99,34.22 C11.1 36.87,34.42 36.87,34.43 35.59,35.71 35.59,36.26 34.68,37.18 34.68,39.76 33.61,40.82 v33.61,41.07 | C41.1 79.86,33.96 79.85,33.95 79.73,34.08 v78.67,34.08 79.6,34.08 79.85,34.33 79.85,35.14 79.83,35.16 79.85,35.18 C15.1 | C43.1 81.24,26.27 v81.24,27.37 | C46.1 78.61,39.06 v78.24,38.7 | C20.1 74.58,47.67 v74.58,48.24 | C52.1 21.97,36.09 v21.21,35.33 | v37.79,32.88 37.79,32.75 39.03,31.51 39.03,27.27 v39.31,26.98 v39.32,26.98 | v3.58,43.37 3.42,43.53 3.4,43.53 | J4.16 37.56,65.48 37.56,60.97 40.72,57.81 43.95,57.81 47.48,54.28 | 84.74,7.71 IC5.8 | 86.69,7.72 IC5.8 | v36.1,69.56 v36.11,69.55 | 89.35,7.72 89.35,8.02 88.93,8.02 88.63,7.72 IC5.8 | 70.49,67.47 v70.49,67.5 70.54,67.5 74.46,63.58 74.47,63.58
  Bottom 0.61: C42.1 81.84,26.02 81.84,26.01 81.05,26.01 C43.1 | v38.45,21.16 39.62,22.33 v41.28,22.33 | J4.16 | 47.48,54.28 v47.48,54.25 | v72.58,7.39 72.57,7.39 70.81,5.63 v70.81,3.66 | v70.49,67.5 70.51,67.61 | v36.11,69.55 41.94,69.55 42.01,69.47 v42.04,69.44 | C14.1 54.1,54.48 54.09,54.49 54.09,54.48 C18.1 | v102.92,34.22 102.92,19.28 91.66,8.02 91.65,8.02 91.64,8.01 91.64,8.02 C49.2
  Bottom 0.813: IC9.2 31.45,26.58 v32.87,25.16 | v27.61,26.59 v27.6,26.59 | 27.62,26.5 27.01,27.12 27.01,28.5 24.57,28.5 21.21,31.88 21.2,33.39 21.21,33.39 | v21.21,35.32 v21.21,35.33 21.21,35.19 21.2,35.18 21.21,35.17 21.21,33.55 21.21,33.46 v13.83,33.46 | v82.05,41.45 92.31,41.45 v98.08,35.69
+5V  (via drill 0.4, 0.6)
  Top 0.406: J6.1 45.12,4.04 41.95,7.21 v35.27,7.21
  Top 0.61: J6.1 45.15,3.66 45.16,3.64 45.19,3.66 J6.2 | J5.32 | v55.28,71.12 J5.32
  Top 0.813: IC7.1 22.46,12.48 v22.39,12.31 22.39,12.34 16.87,12.36 15.82,12.36 | 14.78,25.04 18.51,25.04 v20.67,27.2 | R26.2 15.82,18.29 15.82,12.36 | L2.2 15.82,12.36
  Top 1.016: v16.76,30.72 16.76,35.28 11.88,40.17 11.87,40.17 11.87,40.21 11.83,50.34 13.11,51.62 13.11,54.88 v14.83,56.59 | v16.97,16.55 16.95,16.53 16.18,16.53 | C71.+ 79.58,55.98 85.11,55.98 85.58,56.45 85.92,56.45 85.92,56.33 F3.2 86.58,56.42 v88.07,54.92
  Top 1.27: R26.2 15.6,18.62 15.6,20.35 14.49,21.46 14.49,21.83 C73.+
  Top 1.778: C73.+ 14.53,21.86 14.53,24.78 14.78,25.04 C74.+
  Bottom 0.61: 55.3,71.1 55.3,71.09 55.3,71.01 v55.28,71.12 | v35.27,7.21 27.57,7.21 24,10.77 24,12.29 23.97,12.32 23.99,12.34 C76.2
  Bottom 0.813: C76.2 23.95,12.34 23.92,12.31 | 16.24,27.2 16.25,27.2 IC8.3 | 16.24,27.2 v20.67,27.2 16.76,27.2 v16.76,30.72 | 16.24,27.2 16.18,27.13
  Bottom 1.016: v16.97,16.55 16.97,16.42 21.04,12.35 22.39,12.35 v22.39,12.31 22.4,12.29 23.95,12.29 C76.2 | v14.83,56.59 16.12,57.88 16.12,67.62 19.58,71.09 55.3,71.09 88.78,71.09 92.28,67.6 92.27,61.42 92.26,59.09 88.12,54.92 | C72.1 86.05,56.98 86.04,56.97 88.09,54.92 88.12,54.92 | 88.12,54.92 88.12,54.94 88.11,54.92 v88.07,54.92
A0/NBS0  (via drill 0.4)
  Top 0.2: v76.01,42.06 75.64,42.06 75.45,42.25 74.69,42.25 74.39,41.96 72.81,41.96 71.67,43.1 v71.61,43.1 71.6,43.08
  Top 0.254: IC2.15 78.95,39.16 78.65,39.47 v76.79,39.47
  Top 0.305: J5.2 v46.41,62.25
  Bottom 0.2: v71.61,43.1 70.41,43.1 69.63,42.32 63.92,42.32 62.9,41.3 57.42,41.3 56.19,42.54 56.18,48.66 56.99,49.47 57.99,49.47 58.03,49.52 58.07,49.52 58.86,50.31 58.86,51.27 58.87,51.28 58.86,51.29 IC1.133 58.88,51.35 | v46.41,62.25 47.18,61.47 49.65,61.47 49.92,61.47 54.12,57.26 55.25,56.15 55.59,56.14 55.69,56.13 58.88,52.94 58.88,51.35 | 58.88,51.35 58.88,51.19
  Bottom 0.254: v76.79,39.47 76.01,40.24 76.01,41.48 v76.01,42.06
A1/NBS2  (via drill 0.4)
  Top 0.2: IC3.15 62.09,39.16 62.06,39.19 62.02,39.15
  Top 0.254: 62.23,39.19 IC3.15 62.28,39.18 | 62.28,39.18 62.3,39.18 | v57.62,42.1 57.65,42.1 60.55,39.19 60.56,39.18 60.69,39.18 62.28,39.18
  Top 0.305: J5.3 v47.66,62.26
  Bottom 0.2: IC1.134 59.38,51.37 | IC1.134 59.36,51.28 59.35,51.26 59.38,51.24 59.38,49.81 58.59,49.03 57.22,49.03 56.65,48.45 56.65,43.09 57.62,42.12 v57.62,42.1 | v47.66,62.26 49.69,62.26 49.76,62.24 55.05,56.94 55.49,56.94 59.36,53.07 IC1.134
A2  (via drill 0.4)
  Top 0.2: IC3.23 62.11,45.56 62.11,45.55 61.3,45.55 59.86,46.99 59.86,54.89 v59.18,55.58 v59.17,55.58 | IC2.23 78.61,45.56 v78.6,45.58 | 59.17,55.67 59.17,57.91 | 59.17,57.91 | J5.4 48.93,61.4 51.67,58.65 58.53,58.65 59.17,58.01 59.17,57.91
  Top 0.305: 59.07,55.7 59.18,55.6 59.17,55.6 v59.17,55.58 59.17,55.65 59.18,55.66 59.17,55.67
  Bottom 0.2: IC1.135 59.86,54.88 v59.17,55.58 v59.17,55.59 59.14,55.63 59.14,56.53 59.63,57.03 59.63,57.79 62.22,60.37 73.05,60.36 77.18,56.23 77.18,54.62 79.48,52.31 79.46,46.44 v78.6,45.58
A3  (via drill 0.4)
  Top 0.2: v59.95,56.26 60.37,55.84 60.36,47.2 61.19,46.37 IC3.24 | IC2.24 77.94,46.36 v77.86,46.44 | 59.89,56.3 59.89,57.8 | 59.89,57.8 | J5.5 50.2,60.73 51.87,59.05 58.84,59.05 59.89,58 59.89,57.8
  Top 0.305: 59.84,56.4 59.98,56.26 v59.95,56.26 59.93,56.26 59.89,56.3
  Bottom 0.2: IC1.136 60.36,55.83 v59.95,56.26 59.95,56.32 59.95,56.33 59.95,56.34 60.1,56.49 60.1,56.91 60.1,57.66 62.42,59.97 72.87,59.96 76.75,56.08 76.75,54.46 79.06,52.15 79.04,47.62 v77.86,46.44
A4  (via drill 0.4)
  Top 0.2: v60.8,56.96 60.87,56.89 60.87,47.85 61.58,47.13 62.16,47.13 62.18,47.16 IC3.25 | IC2.25 78.27,47.16 v77.85,47.58 | 60.78,56.94 60.76,56.96 | 60.81,56.97 60.81,56.95 60.82,56.97 | 60.81,57.83 60.82,57.33 60.81,56.97 | J5.6 51.47,60.07 52.07,59.47 59.2,59.47 60.81,57.85 60.81,56.97
  Top 0.305: 60.78,56.94 v60.8,56.96 v60.8,56.95 | v60.8,56.95 | v60.8,56.95 60.82,56.97
  Bottom 0.2: IC1.137 60.87,56.89 v60.8,56.96 v60.79,56.96 v60.79,56.95 60.77,56.98 60.77,57.74 62.6,59.57 72.69,59.56 76.34,55.9 76.34,54.3 78.65,52 78.63,48.36 v77.85,47.58
A5  (via drill 0.4)
  Top 0.2: IC3.26 62.28,47.96 62.29,47.97 61.55,47.97 61.3,48.22 61.3,49.41 61.65,49.75 v61.65,57.59 61.65,57.72 59.5,59.87 54.01,59.87 52.74,61.14 J5.7 | IC2.26 78.61,47.96 v77.84,48.74
  Top 0.305: v61.65,57.59 v61.65,57.6 61.67,57.62 61.68,57.58 | v61.65,57.59 61.67,57.59 | 61.68,57.58 61.67,57.59 61.67,57.6 | 61.68,57.58 61.69,57.59 | v61.65,57.59 v61.66,57.6
  Bottom 0.2: IC1.138 61.36,56.5 61.65,56.78 61.65,57.5 v61.65,57.59 61.65,57.62 63.19,59.16 72.5,59.16 75.89,55.76 75.89,54.12 78.24,51.78 78.22,49.13 v77.84,48.74
A6  (via drill 0.4)
  Top 0.2: IC3.29 51.28,47.99 53.36,47.99 53.68,47.67 55.88,47.67 56.2,47.99 57.21,47.99 v57.51,48.29 v57.52,48.29 | J5.8 54.01,61.36 55.1,60.27 60.15,60.27 62.38,58.04 62.38,56.88 62.39,56.87 v62.38,56.86
  Top 0.254: IC2.29 67.93,47.96 v67.73,48.16 | 62.39,56.9 62.38,56.89 v62.38,56.86
  Bottom 0.2: v67.73,48.16 67.84,48.05 67.84,47.88 67.84,44.51 66.12,42.79 63.92,42.79 63.7,42.79 62.61,41.7 59.15,41.7 57.1,43.75 57.09,47.87 v57.52,48.29 57.54,48.27 59.85,48.27 59.87,48.29 61.86,50.29 IC1.139 61.86,56.35 v62.38,56.86
A7  (via drill 0.4)
  Top 0.2: IC3.30 57.87,47.16 58.04,47.33 v58.1,47.4 | J5.9 55.28,61.36 55.97,60.67 60.35,60.67 63.16,57.87 63.16,56.32 63.12,56.28
  Top 0.254: IC2.30 67.22,47.16 v67.11,47.27 | v62.68,55.83 v62.68,55.84 63.12,56.28
  Bottom 0.2: v67.11,47.27 67.28,47.1 67.28,44.61 65.87,43.2 63.74,43.2 | 63.74,43.2 | 63.74,43.2 63.49,43.2 62.4,42.1 59.32,42.1 57.72,43.7 57.72,47.02 v58.1,47.4 v58.11,47.38 59.53,47.38 59.54,47.4 62.36,50.2 IC1.140 62.35,51.38 62.35,55.51 62.55,55.72 v62.68,55.83
A8  (via drill 0.4)
  Top 0.2: IC3.31 58.59,46.36 58.69,46.47 58.7,46.47 58.7,46.48 v58.85,46.64 | J5.10 56.55,61.85 57.31,61.08 60.55,61.08 63.51,58.11 63.61,58.01 63.61,55.34 63.59,55.33
  Top 0.254: IC2.31 66.49,46.36 v66.43,46.42 | v63.13,54.87 63.59,55.33
  Bottom 0.2: v58.85,46.64 v58.86,46.64 58.4,46.18 58.4,43.59 58.98,43.01 59.49,42.51 61.91,42.51 63.03,43.62 65.58,43.62 66.76,44.81 66.76,46.09 v66.43,46.42 | v58.85,46.64 | v58.85,46.64 59.46,46.64 62.86,50.04 IC1.141 62.87,54.59 v63.13,54.87
A9  (via drill 0.4)
  Top 0.2: IC3.32 58.78,45.56 59.25,45.58 v59.6,45.93 | J5.11 57.82,62.15 58.48,61.49 60.75,61.49 64.33,57.91 v64.33,56.83 v64.34,56.83
  Top 0.254: IC2.32 65.88,45.56 v65.78,45.56 | v64.34,56.83 64.31,56.86
  Bottom 0.2: 63.36,49.26 IC1.142 63.36,51.84 63.34,51.87 63.34,54.05 64.03,54.75 64.03,56.54 v64.34,56.83 | 63.36,49.26 | 63.36,49.26 60.03,45.93 v59.6,45.93 58.93,45.26 58.93,43.63 58.94,43.63 59.65,42.92 61.65,42.92 62.85,44.11 64.29,44.11 64.32,44.11 64.35,44.11 65.32,44.11 66.16,44.95 66.16,45.19 v65.78,45.56
A10  (via drill 0.4)
  Top 0.2: IC3.33 51.25,44.73 58.09,44.73 58.11,44.74 59.47,44.74 v59.65,44.91 | v64.04,53.71 64.07,53.75 64.07,54.52 64.08,54.53 64.08,55.38 65.06,56.37 65.06,57.8 60.97,61.9 59.47,61.9 59.09,62.27 J5.12
  Top 0.254: IC2.33 65.03,44.77 v64.93,44.86
  Bottom 0.2: v64.93,44.86 64.83,44.77 62.89,44.77 61.45,43.33 61.32,43.33 59.81,43.33 59.53,43.61 59.53,44.79 v59.65,44.91 59.65,44.89 59.68,44.89 59.71,44.92 59.71,44.93 63.84,49.06 63.87,49.09 IC1.143 | v64.04,53.71 63.86,53.53 IC1.143 | IC1.143
A11  (via drill 0.4)
  Top 0.2: IC3.34 51.32,43.96 51.34,43.97 60.16,43.96 v60.25,44.05 | 64.72,43.96 64.2,44.48 64.2,45.3 64.85,45.95 v64.85,46.24 | 65.61,55.07 v65.61,55.14 65.61,57.84 61.15,62.31 60.69,62.31 60.36,62.63 J5.13
  Top 0.254: 64.72,43.96 IC2.34
  Bottom 0.2: 64.13,46.92 61.24,44.04 60.29,44.04 60.27,44.05 v60.25,44.05 | 64.13,46.92 64.87,47.66 64.86,47.66 64.86,51.27 64.87,51.27 64.86,51.27 IC1.145 64.86,52.94 65.61,53.68 v65.61,55.14 | 64.13,46.92 | v64.85,46.24 64.82,46.24 64.13,46.92
A12  (via drill 0.4)
  Top 0.2: J5.14 61.63,62.5 v66.34,57.79
  Bottom 0.2: IC1.148 66.36,54.97 66.37,54.97 66.37,57.76 v66.34,57.79
A13  (via drill 0.4)
  Top 0.2: 66.6,50.92 | v66.6,50.05 66.6,50.92 | IC2.35 69,43.14 69.84,43.14 70.03,43.33 70.04,47.52 72.05,49.52 72.05,50.93 71.18,51.79 67.46,51.79 66.64,50.97 | v55.41,48.38 55.41,48.57 55.47,48.63 57.52,50.68 58.41,51.58 58.41,56.65 v58.4,56.63 | 66.64,50.97 66.6,50.93 66.6,50.92 | 66.62,50.94 66.6,50.92 | 66.62,50.94 66.64,50.97 | 66.6,50.92 66.62,50.95 66.62,50.94
  Top 0.254: IC3.35 v54.56,43.16 | J5.15 62.9,62.24 64.04,61.1 67.35,61.1 v67.27,61.1
  Top 0.305: v67.27,61.1 v67.27,58.4
  Bottom 0.2: v66.6,50.05 66.6,50.08 66.6,50.36 66.86,50.64 IC1.149 66.86,55.06 66.86,55.07 66.86,57.18 67.27,57.59 v67.27,58.4
  Bottom 0.254: v54.56,43.16 55.31,43.91 55.31,48.31 55.39,48.38 v55.41,48.38
  Bottom 0.305: v58.4,56.63 58.48,56.63 59.15,57.3 59.15,58.55 60.23,59.63 61.7,61.1 v67.27,61.1
A14  (via drill 0.4)
  Top 0.2: v67.61,50.06 67.61,50.46 68.2,51.04 70.72,51.04 v71.26,50.5 | v72.75,49.99 72.75,49.65 70.45,47.35 70.45,42.96 69.86,42.36 69.18,42.36 69.13,42.31 69.07,42.36 IC2.36 | v54.34,48.4 54.34,48.54 56.63,50.83 57.57,51.77 57.57,56.9 v58.35,57.67
  Top 0.254: IC3.36 v53.41,42.36 | J5.16 64.17,62.32 64.64,61.84 67.66,61.84 68.29,61.22 v68.39,61.09 | v68.4,58.4 68.42,58.42 68.42,61.08 68.32,61.09
  Top 0.305: v68.39,61.09 68.32,61.09
  Bottom 0.2: 67.61,50.1 67.61,50.12 | 67.61,50.1 v67.61,50.06 | 67.61,50.1 67.36,50.35 IC1.150 67.36,55.13 67.36,55.52 67.36,56.76 68.41,57.8 68.41,58.31 68.42,58.38 v68.4,58.4 | v71.26,50.5 71.77,49.99 v72.75,49.99
  Bottom 0.254: v53.41,42.36 53.41,47.48 v54.34,48.4
  Bottom 0.305: v58.35,57.67 58.35,58.83 58.37,58.85 61.38,61.87 67.74,61.87 68.34,61.27 68.34,61.12 68.29,61.12 v68.39,61.09
A15  (via drill 0.4)
  Top 0.2: J5.17 65.44,62.7 65.83,62.31 68.38,62.31 69.37,61.32 69.52,61.16 69.52,58.44 v69.53,58.38
  Bottom 0.2: IC1.151 67.87,55.22 67.86,55.23 67.86,56.3 69.38,57.81 69.53,57.97 v69.53,58.38
A16/BA0  (via drill 0.4)
  Top 0.2: IC2.20 80,43.14 77.53,43.15 v77.43,43.15 | IC3.20 62.38,43.16 62.39,43.16 62.97,43.16 63.79,43.98 63.79,46.34 64.4,46.95 65.92,46.95 66.38,47.42 66.38,48.13 v65.69,48.82 | v72.14,51.9 72.12,51.91 v72.12,53.44 | v74.98,55.53 74.52,55.99 74.52,58.35 72.47,60.4 72.47,64.29 71.69,65.08 71.69,66.52 71.67,66.75 68.61,66.75 67.89,66.03 67.11,66.03 66.69,65.61 66.69,64.18 | 66.69,64.18 66.69,64.14 | 66.69,64.18 J5.18
  Bottom 0.2: v77.43,43.15 77.43,43.65 76.08,45 76.08,47.85 76.08,47.88 74.53,49.42 74.49,49.47 72.55,51.42 72.26,51.69 72.14,51.81 v72.14,51.9 | v65.69,48.82 66.57,48.82 67.06,49.32 69.06,49.32 69.28,49.54 69.36,49.63 IC1.154 69.36,52.24 70.55,53.43 72.03,53.43 72.13,53.43 v72.12,53.44 v72.12,53.43 72.88,53.43 v74.98,55.53
A17/BA1  (via drill 0.4)
  Top 0.2: IC2.21 80.01,43.96 80.06,43.91 v78.25,43.91 | v65.65,47.7 64.32,47.7 63.37,46.74 63.37,44.43 62.93,43.99 62.42,43.99 62.41,44.01 62.37,43.96 IC3.21 | 75.02,54.43 v75.02,54.31 75.02,54.34 74.11,55.25 74.11,58.12 72.02,60.21 72.02,64.12 71.28,64.87 71.28,66.3 69.02,66.3 68.71,65.99 67.98,65.26 J5.19
  Bottom 0.2: v78.25,43.91 v78.24,43.91 77.88,44.28 77.46,44.28 76.52,45.22 76.52,48.02 72.94,51.6 72.94,52.65 | v65.65,47.7 66.01,47.7 67.22,48.9 67.82,48.9 68.11,48.9 69.31,48.9 69.86,49.45 IC1.155 69.86,52.15 70.28,52.56 70.27,52.56 70.36,52.65 72.39,52.65 | 72.94,52.65 73.36,52.65 v75.02,54.31 | 72.39,52.65 72.42,52.65 | 72.39,52.65 72.94,52.65 | 72.39,52.65
AGND  (via drill 0.4)
  Top 0.305: 22.19,43.06 22.2,43.07 v22.71,43.58 | v22.71,43.58
  Top 0.406: R13.1 | R13.1 | v21.07,55.84 21.06,55.7 R13.1 | R23.2 22.02,40.54 22.37,40.89 22.37,42.91 22.2,43.07 22.06,43.22 21.09,43.22 21.08,43.23 | 21.08,43.23 21.05,43.26 | 21.08,43.23 C69.2 | v21.85,46.33 21.85,46.26 22.7,45.4 v22.7,43.59 v22.71,43.58
  Top 0.813: R13.1 22,54.7 21.98,54.73 21.95,54.7 R14.1
  Bottom 0.2: IC6.26 26.61,48.59 26.38,48.35 25.62,48.35 25.62,49.12 | IC6.24 25.62,49.41 | IC6.27 27.11,48.42 28.06,47.47 31.59,47.47 | 31.59,47.47 31.61,47.49 | 31.59,47.47 IC6.33 | 23.91,48.48 23.63,48.76 23.63,49.41 | 10.74,52.2 10.75,52.2 J3.S2 10.75,51.8 10.7,52.19
  Bottom 0.254: IC6.27 27.13,49.4 | IC6.27 27.11,49.63 26.68,49.63 | IC6.26 IC6.27 | 25.62,49.41 25.62,49.12 | C64.2 18.02,41.99 18.35,41.99 19.33,42.97 IC6.7 21.54,42.97 | 21.54,42.97 22.1,42.97 v22.71,43.58 | IC6.10 21.19,44.47 21.53,44.13 21.53,42.99 21.54,42.98 21.54,42.97 | C65.2 18.25,46.46 20.18,46.46 IC6.14 21.7,46.47 21.84,46.33 v21.85,46.33 21.94,46.33 23.11,47.49 23.6,47.49 23.91,47.8 23.91,48.38 | 23.91,48.38 23.91,48.48 | 23.63,49.41 IC6.20 | 23.91,48.38 25.61,48.38 | IC6.24 25.61,52.96 24.71,53.87 23.23,53.87 23.21,53.89 | 23.21,53.89 23.2,53.9 | C67.2 23.21,53.89
  Bottom 0.406: C66.2 C63.2 21.8,53.98 21.86,54.04 21.85,54.9 | C67.2 21.85,53.85 21.85,54.9 | 21.85,54.9 21.06,55.69 v21.07,55.84 | C65.2 17.62,46.29 15.82,46.29 14.63,47.48 10.46,47.48 | 10.56,36.78 10.56,36.8 | 10.56,36.78 10.52,36.78 | J3.S1 10.56,36.47 10.56,36.78
  Bottom 0.61: 10.48,46.3 10.52,44.86 | 10.48,46.3 C59.2 | C58.2 10.52,46.26 10.48,46.3 | 10.52,36.78 10.52,44.11 | 16.76,39.91 17.99,41.14 17.99,41.94 C64.2
  Bottom 0.813: C58.2 10.46,46.31 10.46,47.48 10.46,48.42 10.74,48.7 10.74,52.2 | 10.48,46.3 10.5,44.03 10.52,44.11 | C61.1 15.79,52.72 17.12,51.39 17.1,51.37 C60.1 17.24,53 18.1,53.86 20.17,53.86 20.18,53.87 | 20.18,53.87 20.2,53.88 | 20.18,53.87 C66.2 | 16.55,39.87 16.54,39.86 | 16.55,39.87 J3.8 | 16.76,39.91 16.59,39.91 16.55,39.87
  Bottom 1.016: C61.1 10.7,52.72 10.7,52.19
BMS/DTXD  (via drill 0.4)
  Top 0.2: v40.18,36.15 40.18,36.28
  Top 0.254: 40.18,36.28 40.18,36.78 39.5,37.46 39.5,44.94 34.39,50.04 34.39,54.54 v32.91,56.02 | J4.6 23.43,66.9 23.43,66.86 23.49,66.86
  Top 0.813: J4.6 | J4.6 | R31.2 22.79,67.54 J4.6
  Bottom 0.2: IC1.79 40.34,36.32 v40.18,36.15
  Bottom 0.254: v32.91,56.02 32.91,58.11 27.21,63.8 27.21,65.02 26.57,65.67 24.7,65.67 23.49,66.88 23.45,66.88 J4.6
CAS  (via drill 0.4)
  Top 0.254: IC3.17 62.95,40.76 64.89,38.82 v67.19,38.82 | IC2.17 80.01,40.75 | IC2.17 | v70.33,38.82 72.26,40.75 IC2.17
  Top 0.305: IC2.17 79.98,40.75
  Bottom 0.2: v70.33,38.82 IC1.177 | v70.33,38.82
  Bottom 0.254: v67.19,38.82 70.25,38.82
  Bottom 0.305: v70.33,38.82 70.29,38.82 70.27,38.8 70.25,38.82
D0  (via drill 0.4)
  Top 0.2: v88.27,37.72 88.28,30.44 86.55,28.71 80.11,28.71 80.02,28.63 79.99,28.66 IC2.2
  Top 0.406: J6.14 61.64,3.7 v61.64,1.78
  Bottom 0.2: IC1.179 88.27,37.8 v88.27,37.72 88.27,24.35 73.37,9.46 | 62.08,2.1 62.01,2.1 | 62.08,2.1 66.02,2.1 73.37,9.46 | 73.37,9.46 | v61.64,1.78 61.95,2.1 62.08,2.1 | 62.08,2.1 | 62.08,2.1
D1  (via drill 0.4)
  Top 0.2: v87.48,36.99 87.48,31.15 86.69,30.36 80.29,30.36 80.27,30.36 80.26,30.36 IC2.4
  Top 0.406: J6.13 60.35,3.61 v60.34,1.77
  Bottom 0.2: IC1.180 87.09,37.3 v87.48,36.99 v87.47,36.98 87.47,24.15 65.82,2.5 60.61,2.5 60.34,2.23 v60.34,1.77
D2  (via drill 0.4)
  Top 0.2: v86.63,36.22 86.63,31.48 86.31,31.17 80.22,31.16 80.16,31.12 80.13,31.16 IC2.5
  Top 0.406: J6.12 59.1,3.71 v59.1,1.77
  Bottom 0.2: IC1.181 86.03,36.82 v86.63,36.22 v86.62,36.21 86.62,23.9 73.01,10.29 65.63,2.91 65.51,2.91 59.39,2.91 59.1,2.62 v59.1,1.77
D3  (via drill 0.4)
  Top 0.2: v85.84,35.58 85.84,32.98 85.66,32.79 80.19,32.81 80.14,32.76 IC2.7
  Top 0.406: J6.11 57.83,3.68 v57.83,1.75
  Bottom 0.2: IC1.182 85.09,36.31 v85.84,35.58 v85.84,35.57 85.84,23.7 72.55,10.41 65.47,3.32 58.17,3.32 57.83,2.97 v57.83,1.75
D4  (via drill 0.4)
  Top 0.2: IC2.8 79.9,33.56 79.89,33.56 83.45,33.54 | 83.45,33.54 83.58,33.54 | v85.06,34.93 85.39,34.61 85.38,33.73 84.86,33.21 83.93,33.21 83.61,33.54 83.45,33.54
  Top 0.406: J6.10 56.55,1.8 v56.55,1.76
  Bottom 0.2: IC1.185 75.75,34.82 78.11,32.46 78.61,32.46 79.7,31.36 82.97,31.36 83.54,31.94 83.55,34.63 84,35.09 84.92,35.09 v85.06,34.93 85.06,23.5 72.36,10.8 65.28,3.72 57.08,3.72 56.55,3.2 v56.55,1.76
D5  (via drill 0.4)
  Top 0.2: IC2.10 80,35.18 81.39,35.17 82.27,34.28 84.28,34.28 v84.29,34.27
  Top 0.406: J6.9 55.28,3.62 v55.28,1.75
  Bottom 0.2: IC1.186 75.64,34.32 77.95,32.01 78.39,32.01 79.44,30.95 83.34,30.95 84.3,30.95 | 84.3,30.95 84.3,31 84.3,33.95 v84.29,34.27 | 84.3,30.95 84.29,31.81 84.29,23.31 72.21,11.23 65.11,4.13 56.25,4.13 55.27,3.14 55.27,1.72 v55.28,1.75
D6  (via drill 0.4)
  Top 0.2: 79.93,35.97 79.94,35.96 IC2.11 79.95,35.93 79.35,35.93 77.77,34.35 77.75,31.56 78.06,31.25 v78.08,31.25
  Top 0.406: J6.8 54.01,3.62 v54.01,1.77
  Bottom 0.2: IC1.187 75.52,33.82 78.01,31.32 78.01,31.29 78.05,31.29 v78.08,31.25 78.81,30.53 78.81,25.45 80.3,24 80.3,22.03 80.54,21.78 80.54,20.13 64.94,4.53 56.04,4.53 54.07,2.56 | 54.07,2.56 54.03,2.5 | 54.07,2.56 54.01,2.49 v54.01,1.77
D7  (via drill 0.4)
  Top 0.2: v77.21,30.5 77.21,34.47 77.67,34.93 77.67,36.12 79.14,37.59 79.87,37.57 79.88,37.56 IC2.13
  Top 0.406: J6.7 52.74,1.91 v52.74,1.77
  Bottom 0.2: IC1.190 75.37,32.34 75.4,32.34 77.21,30.53 v77.21,30.5 78.36,29.36 78.36,25.28 79.86,23.77 79.86,21.15 80.11,20.9 80.11,20.32 64.73,4.93 55.05,4.93 52.76,2.62 52.75,2.61 52.75,2.17 52.75,2.14 52.74,2.12 52.74,2.1 v52.74,1.77
D8  (via drill 0.4)
  Top 0.2: v77.92,24.47 73.34,29.05 73.33,34.54 70.35,37.52 68.98,37.53 68.96,37.56 IC2.42
  Top 0.406: J6.27 61.63,8.11 61.64,8.11 61.63,8.12 v61.63,9.92
  Bottom 0.2: IC1.191 74.73,31.82 77.59,28.96 arc-90 77.62,28.93 77.62,24.76 77.63,24.76 v77.92,24.47 | v77.92,24.47 v77.93,24.46 | v77.92,24.47 78.33,24.06 78.34,20.76 78.29,20.71 75.03,17.46 75.03,16.14 69.54,10.65 63.16,10.64 62.35,10.64 v61.63,9.92
D9  (via drill 0.4)
  Top 0.2: v77.61,23.33 72.91,28.03 72.9,32.56 69.55,35.92 69.08,35.92 69.04,35.96 69.03,35.96 IC2.44
  Top 0.406: J6.28 v60.36,9.92
  Bottom 0.2: IC1.192 74.6,31.32 77.19,28.73 77.2,23.74 v77.61,23.33 | v77.61,23.33 | v77.61,23.33 77.79,23.16 77.79,20.78 74.62,17.61 74.62,16.32 69.34,11.05 62.41,11.05 62.24,11.05 61.49,11.05 v60.36,9.92
D10  (via drill 0.4)
  Top 0.2: v77.07,22.3 76.9,22.46 72.49,26.87 72.49,32.14 69.47,35.16 IC2.45
  Top 0.406: J6.29 59.09,8.08 59.1,8.1 59.09,8.11 v59.09,9.93
  Bottom 0.2: IC1.193 74.48,30.82 76.76,28.52 76.76,22.61 77,22.37 77.01,22.37 v77.07,22.3 77.07,20.63 74.22,17.78 74.22,16.49 69.19,11.47 61.41,11.47 60.63,11.47 v59.09,9.93
D11  (via drill 0.4)
  Top 0.2: v76.2,21.48 v76.2,21.49 76.2,21.88 72.08,25.99 72.08,31.14 69.66,33.56 69.02,33.56 68.98,33.59 | 68.98,33.59 68.97,33.6 | 68.98,33.59 IC2.47
  Top 0.406: v57.84,9.98 57.84,9.96 57.82,9.94 J6.30
  Bottom 0.2: IC1.194 74.37,30.32 76.33,28.36 76.33,21.63 76.2,21.5 v76.2,21.48 76.2,20.33 73.81,17.94 73.81,16.66 69.03,11.87 60.03,11.88 58.65,10.5 58.37,10.5 v57.84,9.98
D12  (via drill 0.4)
  Top 0.2: v75.25,20.95 75.26,22.17 71.67,25.76 71.67,30.6 69.51,32.76 IC2.48
  Top 0.406: v56.58,10 56.58,9.89 56.55,9.87 J6.31
  Bottom 0.2: IC1.195 74.19,29.82 75.87,28.14 75.87,22.23 75.26,21.62 75.26,21 75.25,20.99 v75.25,20.95 75.25,19.96 73.39,18.1 73.39,16.82 68.87,12.3 59.82,12.3 58.45,10.93 57.51,10.93 v56.58,10
D13  (via drill 0.4)
  Top 0.2: v73.87,20.4 73.86,21.45 71.17,24.14 71.17,25.1 70.83,25.44 70.83,29.85 69.55,31.14 69.04,31.14 69.02,31.12 IC2.50
  Top 0.406: v55.31,9.98 55.31,9.91 55.27,9.87 55.28,9.86 J6.32
  Bottom 0.2: IC1.196 74.08,29.32 75.47,27.93 75.47,22.43 73.87,20.83 73.87,20.47 v73.87,20.4 73.87,19.17 72.99,18.29 72.99,16.99 68.71,12.71 59.65,12.71 58.27,11.34 56.67,11.34 v55.31,9.98
D14  (via drill 0.4)
  Top 0.2: IC2.51 69.01,30.36 69.02,30.36 69.66,30.36 70.43,29.59 70.43,25.25 70.77,24.91 70.77,23.89 72.93,21.73 v72.93,19.89
  Top 0.406: v54.04,9.98 54.04,9.91 54,9.87 54.01,9.87 J6.33
  Bottom 0.2: IC1.197 73.96,28.82 75.04,27.73 75.04,22.65 72.93,20.53 72.93,19.93 72.93,19.92 v72.93,19.89 72.93,18.81 72.58,18.47 72.58,17.15 68.56,13.13 59.44,13.14 58.06,11.76 55.82,11.76 v54.04,9.98
D15  (via drill 0.4)
  Top 0.2: IC2.53 69.07,28.76 69.09,28.73 69.76,28.73 70.02,28.48 70.02,25.07 70.33,24.75 70.33,23.72 70.51,23.54 72.17,21.87 v72.17,19.13
  Top 0.406: v52.75,9.99 52.75,9.89 52.74,9.87 J6.34
  Bottom 0.2: IC1.198 73.77,28.32 74.62,27.47 74.62,22.81 74.6,22.78 72.17,20.36 | v72.17,19.13 72.17,17.31 68.41,13.55 59.2,13.55 57.83,12.18 54.93,12.18 v52.75,9.99 | v72.17,19.13 | 72.17,20.36 | v72.17,19.13 72.17,20.36
D16  (via drill 0.4)
  Top 0.2: v58.45,34.2 58.45,31.85 61.53,28.78 62.25,28.78 IC3.2 | IC3.2 62.3,28.73 | IC3.2
  Bottom 0.2: IC1.201 71.72,26.82 69.36,29.17 67.83,29.17 63,33.99 59.88,33.99 59.66,34.2 v58.45,34.2
D17  (via drill 0.4)
  Top 0.2: v59.28,33.48 59.29,31.68 60.6,30.37 62.29,30.36 | 62.29,30.36 62.31,30.38 | 62.29,30.36 IC3.4 | 62.29,30.36
  Bottom 0.2: IC1.202 71.63,26.32 69.19,28.77 67.63,28.77 62.96,33.43 62.91,33.48 v59.28,33.48
D18  (via drill 0.4)